# EAGLE design Advertisement Matrix (EAGLE 6.4)
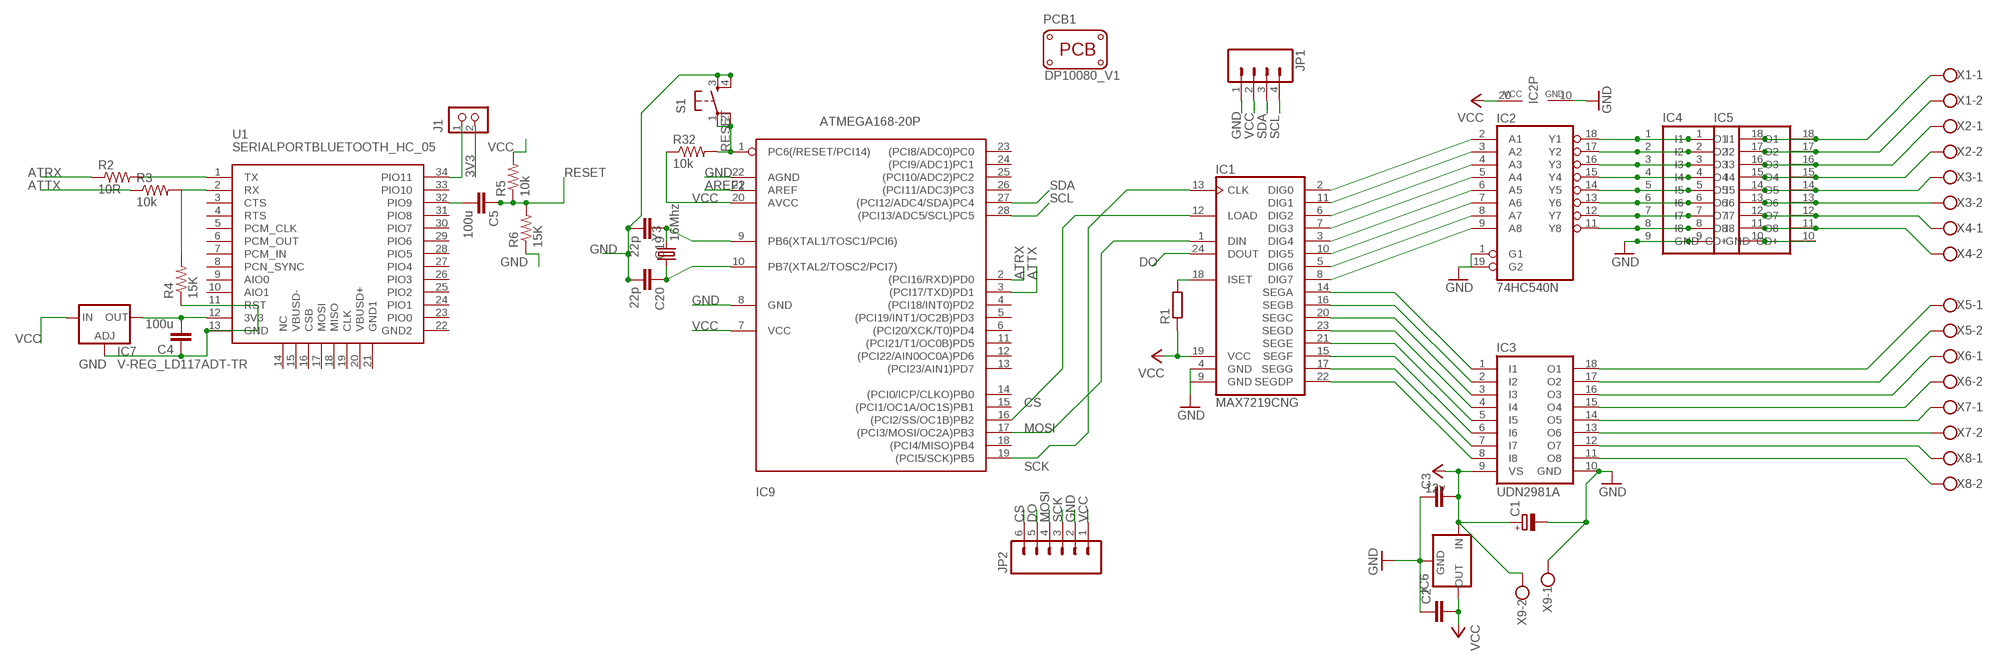
[diagram p0: schematic, sheet 1]

## Parts
C1  CPOL-EUE2.5-7  [E2,5-7]
C2  C-EUC1206K  [C1206K]
C3  C-EUC1206K  [C1206K]
C4  100u  CAP1206  [1206]
C5  100u  CAP1206  [1206]
C19  22p  CAP1206  [1206]
C20  22p  CAP1206  [1206]
IC1  MAX7219CNG  [DIL24-3]
IC2  74HC540N  [DIL20]
IC3  UDN2981A  [DIL18]
IC4  IC_ULN2803AN  [DIL18]
IC5  IC_ULN2803AN  [DIL18]
IC6  78XXL  [78XXL]
IC7  V-REG_LD117ADT-TR  [V-REG_DPACK]
IC9  ATMEGA168-20P  [DIL28-3]
J1  CON_HEADER_1X02-PTH  [M1X2]
JP1  M04POLAR_LOCK  [MOLEX-1X4_LOCK]
JP2  M06POLAR_LOCK  [MOLEX-1X6_LOCK]
PCB1  PCB_DP_RECTANGLE-80X100  [DP10080_V1]
R1  R-EU_0207/7  [0207/7]
R2  10R  R-US_M1206  [M1206]
R3  10k  R-US_M1206  [M1206]
R4  15K  R-US_M1206  [M1206]
R5  10k  R-US_M1206  [M1206]
R6  15K  R-US_M1206  [M1206]
R32  10k  R-US_M1206  [M1206]
S1  TAC_SWITCHPTH  [TACTILE-PTH]
U1  SERIALPORTBLUETOOTH_HC_05  [SERIALPORTBLUETOOTH_BLUETOOTH_SMD]
X1  W237-102  [W237-102]
X2  W237-102  [W237-102]
X3  W237-102  [W237-102]
X4  W237-102  [W237-102]
X5  W237-102  [W237-102]
X6  W237-102  [W237-102]
X7  W237-102  [W237-102]
X8  W237-102  [W237-102]
X9  W237-102  [W237-102]
Y3  16Mhz  CRYSTALSMD  [HC49UP]

## Nets
3V3: C4.2 IC7.4(OUT) J1.2 U1.12(3V3)
12V: C1.+ C3.2 IC3.9(VS) IC6.IN X9.2 ; supply symbol labelled 12v
AREF2: IC9.21(AREF)
ATRX: IC9.2((PCI16/RXD)PD0) R2.1
ATTX: IC9.3((PCI17/TXD)PD1) R3.1
CS: IC1.12(LOAD) IC9.16((PCI2/SS/OC1B)PB2) JP2.6
DO: IC1.24(DOUT) JP2.5
GND: C1.- C2.1 C3.1 C4.1 C19.2 C20.2 IC1.4(GND) IC1.9(GND) IC2.1(G1) IC2.10(GND) IC2.19(G2) IC3.10(GND) IC4.9(GND) IC5.9(GND) IC6.GND IC7.1(ADJ) IC9.8(GND) IC9.22(AGND) JP1.1 JP2.2 R4.1 R6.1 S1.3 S1.4 U1.13(GND) X9.1
MOSI: IC1.1(DIN) IC9.17((PCI3/MOSI/OC2A)PB3) JP2.4
N$1: IC1.2(DIG0) IC2.2(A1)
N$2: IC1.11(DIG1) IC2.3(A2)
N$3: IC1.6(DIG2) IC2.4(A3)
N$4: IC1.7(DIG3) IC2.5(A4)
N$5: IC1.3(DIG4) IC2.6(A5)
N$6: IC1.10(DIG5) IC2.7(A6)
N$7: IC1.5(DIG6) IC2.8(A7)
N$8: IC1.8(DIG7) IC2.9(A8)
N$9: IC1.14(SEGA) IC3.1(I1)
N$10: IC1.16(SEGB) IC3.2(I2)
N$11: IC1.20(SEGC) IC3.3(I3)
N$12: IC1.23(SEGD) IC3.4(I4)
N$13: IC1.21(SEGE) IC3.5(I5)
N$14: IC1.15(SEGF) IC3.6(I6)
N$15: IC1.17(SEGG) IC3.7(I7)
N$16: IC1.22(SEGDP) IC3.8(I8)
N$17: IC2.18(Y1) IC4.1(I1) IC5.1(I1)
N$18: IC2.17(Y2) IC4.2(I2) IC5.2(I2)
N$19: IC2.16(Y3) IC4.3(I3) IC5.3(I3)
N$20: IC2.15(Y4) IC4.4(I4) IC5.4(I4)
N$21: IC2.14(Y5) IC4.5(I5) IC5.5(I5)
N$22: IC2.13(Y6) IC4.6(I6) IC5.6(I6)
N$23: IC2.12(Y7) IC4.7(I7) IC5.7(I7)
N$24: IC2.11(Y8) IC4.8(I8) IC5.8(I8)
N$25: IC3.18(O1) X5.1
N$26: IC3.17(O2) X5.2
N$27: IC3.16(O3) X6.1
N$28: IC3.15(O4) X6.2
N$29: IC3.14(O5) X7.1
N$30: IC3.13(O6) X7.2
N$31: IC3.12(O7) X8.1
N$32: IC3.11(O8) X8.2
N$33: IC4.10(CD+) IC5.10(CD+)
N$34: IC4.11(O8) IC5.11(O8) X4.2
N$35: IC4.12(O7) IC5.12(O7) X4.1
N$36: IC4.13(O6) IC5.13(O6) X3.2
N$37: IC4.14(O5) IC5.14(O5) X3.1
N$38: IC4.15(O4) IC5.15(O4) X2.2
N$39: IC4.16(O3) IC5.16(O3) X2.1
N$40: IC4.17(O2) IC5.17(O2) X1.2
N$41: IC4.18(O1) IC5.18(O1) X1.1
N$42: IC1.18(ISET) R1.2
N$43: R2.2 U1.1(TX)
N$44: R3.2 R4.2 U1.2(RX)
N$45: J1.1 U1.34(PIO11)
N$47: C5.2 U1.32(PIO9)
RESET: C5.1 IC9.1(PC6(/RESET/PCI14)) R5.1 R6.2 R32.2 S1.1 S1.2
SCK: IC1.13(CLK) IC9.19((PCI5/SCK)PB5) JP2.3
SCL: IC9.28((PCI13/ADC5/SCL)PC5) JP1.4
SDA: IC9.27((PCI12/ADC4/SDA)PC4) JP1.3
VCC: C2.2 IC1.19(VCC) IC2.20(VCC) IC6.OUT IC7.3(IN) IC9.7(VCC) IC9.20(AVCC) JP1.2 JP2.1 R1.1 R5.2 R32.1
XTAL5: C20.1 IC9.10(PB7(XTAL2/TOSC2/PCI7)) Y3.1
XTAL6: C19.1 IC9.9(PB6(XTAL1/TOSC1/PCI6)) Y3.2
Unconnected: IC9.4((PCI18/INT0)PD2) IC9.5((PCI19/INT1/OC2B)PD3) IC9.6((PCI20/XCK/T0)PD4) IC9.11((PCI21/T1/OC0B)PD5) IC9.12((PCI22/AIN0OC0A)PD6) IC9.13((PCI23/AIN1)PD7) IC9.14((PCI0/ICP/CLKO)PB0) IC9.15((PCI1/OC1A/OC1S)PB1) IC9.18((PCI4/MISO)PB4) IC9.23((PCI8/ADC0)PC0) IC9.24((PCI9/ADC1)PC1) IC9.25((PCI10/ADC2)PC2) IC9.26((PCI11/ADC3)PC3) U1.3(CTS) U1.4(RTS) U1.5(PCM_CLK) U1.6(PCM_OUT) U1.7(PCM_IN) U1.8(PCN_SYNC) U1.9(AIO0) U1.10(AIO1) U1.11(RST) U1.14(NC) U1.15(VBUSD-) U1.16(CSB) U1.17(MOSI) U1.18(MISO) U1.19(CLK) U1.20(VBUSD+) U1.21(GND1) U1.22(GND2) U1.23(PIO0) U1.24(PIO1) U1.25(PIO2) U1.26(PIO3) U1.27(PIO4) U1.28(PIO5) U1.29(PIO6) U1.30(PIO7) U1.31(PIO8) U1.33(PIO10)

## Library data of the parts
C1 = resistor:CPOL-EU: POLARIZED CAPACITOR, European symbol
C2 C3 = resistor:C-EU: CAPACITOR, European symbol
C4 C5 C19 C20 = SparkFun-Passives:CAP: Capacitor Standard 0603 ceramic capacitor, and 0.1" leaded capacitor.
IC1 = maxim:MAX7219CNG: LED DISPLAY DRIVER; MF: MAXIM; MPN: MAX7219CNG; OC_FARNELL: 1523914; OC_NEWARK: 34C4018
IC2 = 74xx-eu:74*540: Octal BUFFER and LINE DRIVER, 3-state
IC3 = uln-udn:UDN298*: DRIVER ARRAY Source: Allegro Microsystems Inc. / UDN2981-UDN2984.pdf
IC4 IC5 = dp_devices:IC_ULN2803A: DRIVER ARRAY
IC6 = v-reg:78XXL: VOLTAGE REGULATOR
IC7 = untitled:V-REG_LD117A?*: Low drop fixed and adjustable positive voltage regulators 1 A Source: http://www.st.com/stonline/products/literature/ds/7194/ld1117axx.pdf
IC9 = adafruit:ATMEGA168*P: MICROCONTROLLER 16 kBytes FLASH 1 kBytes SRAM 512 Bytes EEPROM USART 8-channel 10 bit ADC
J1 = dp_devices:CON_HEADER_1X02
JP1 = SparkFun-Connectors:M04: Header 4 Standard 4-pin 0.1" header. Use with straight break away headers (SKU : PRT-00116), right angle break away headers (PRT-00553), swiss pins (PRT-00743), machine pins (PRT-00117), and female headers (PRT-00115). Molex polarized connector foot print use with SKU : PRT-08231 with associated crimp pins and housings. 1MM SMD Version SKU: PRT-10208
JP2 = SparkFun-Connectors:M06: Header 6 Standard 6-pin 0.1" header. Use with straight break away headers (SKU : PRT-00116), right angle break away headers (PRT-00553), swiss pins (PRT-00743), machine pins (PRT-00117), and female headers (PRT-00115). Molex polarized connector foot print use with SKU : PRT-08094 with associated crimp pins and housings. NOTES ON THE VARIANTS LOCK and LOCK_LONGPADS... This footprint was designed to help hold the alignment of a through-hole component (i.e. 6-pin header) while soldering it into place. You may notice that each hole has been shifted either up or down by 0.005 of an inch from it's more standard position (which is a perfectly straight line). This slight alteration caused the pins (the squares in the middle) to touch the edges of the holes. Because they are alternating, it causes a "brace" to hold the component in place. 0.005 has proven to be the perfect amount of "off-center" position when using our standard breakaway headers. Although looks a little odd when you look at the bare footprint, once you have a header in there, the alteration is very hard to notice. Also,if you push a header all the way into place, it is covered up entirely on the bottom side. This idea of altering the position of holes to aid alignment will be further integrated into the Sparkfun Library for other footprints. It can help hold any component with 3 or more connection pins.
PCB1 = dp_devices:PCB_DP_RECTANGLE: Dangerous Prototypes Standard Rectangular PCB sizes; PCB_SIZE: DP10080_V1
R1 = rcl:R-EU_: RESISTOR, European symbol
R2-R6 R32 = resistor:R-US_: RESISTOR, American symbol
S1 = SparkFun-Electromechanical:TAC_SWITCH: Momentary Switch Button commonly used for reset or general input. Spark Fun Electronics SKU : COM-00097 SMT- SWCH-08247
U1 = untitled:SERIALPORTBLUETOOTH_HC_05
X1-X9 = con-wago-500:W237-102: WAGO SCREW CLAMP; MPN: 237-102; OC_FARNELL: unknown; OC_NEWARK: 70K9898
Y3 = SparkFun-FreqCtrl:CRYSTAL: Various standard crystals. Proven footprints. Spark Fun Electronics SKU : COM-00534

## Board
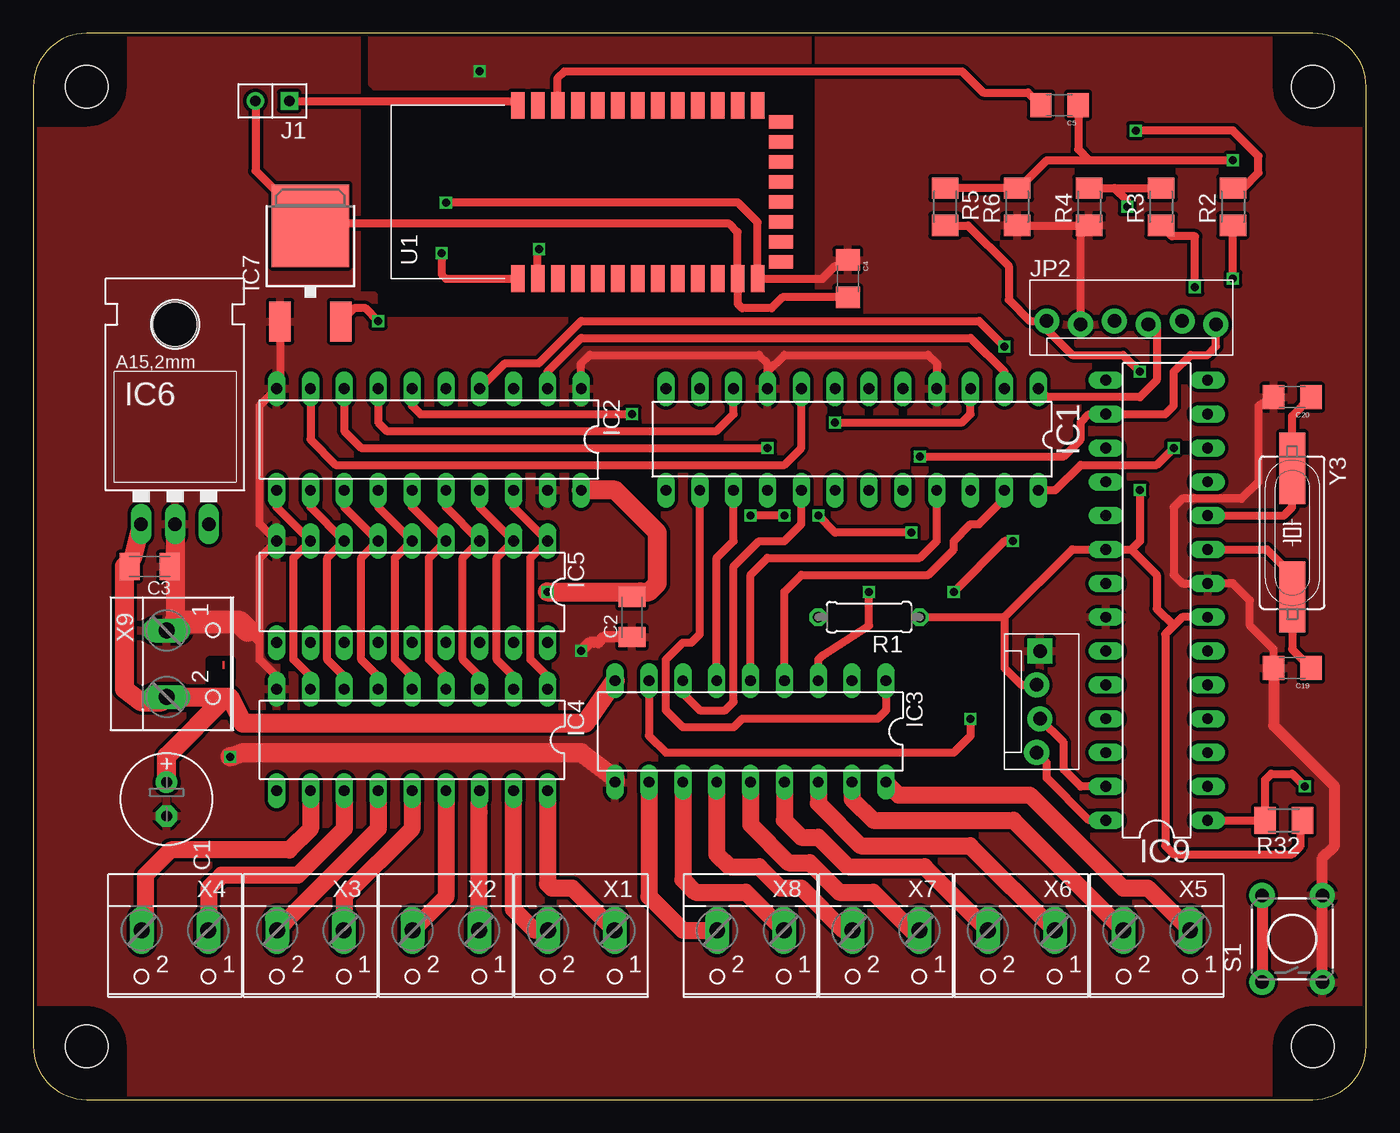
[diagram p1: board, top side]
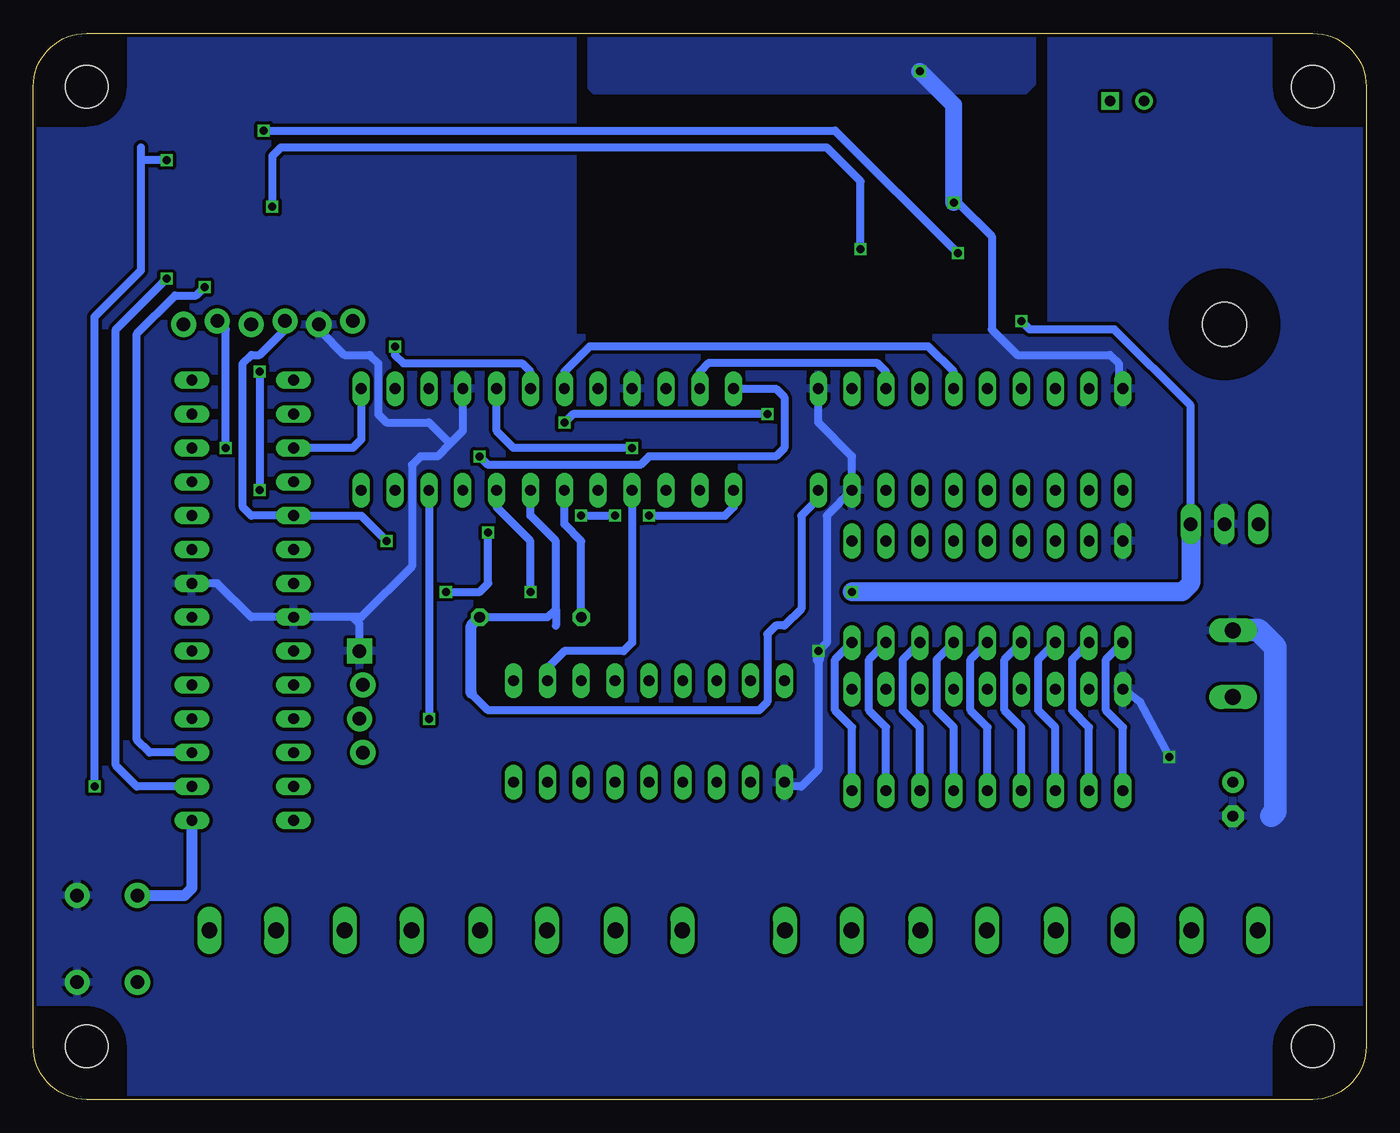
[diagram p2: board, bottom side, seen from below]

Size 100 x 80 mm. Coordinates in mm from the lower left corner, seen from the top.
Copper layers (1*16): Top 0.035mm / dielectric 1.5mm / Bottom 0.035mm
Design rules "dirt_cheap_dirty_boards.v1 *": minimum track width 5mil, minimum drill 12mil, track to track 10mil, track to pad 10mil, pad to pad 10mil, via to via 10mil, smd to smd 0mil, copper to edge 10mil, drill to drill 10mil, minimum pad ring 10mil, minimum via ring 6mil, stop-mask expansion 2mil, vias tented up to drill 25mil, thermal gap 10mil

### Footprints (pad centres in the part's own frame; a part is rotated, then mirrored left to right if it is on the bottom)
E2,5-7 = drill 0.813 pad 1.6: + -1.27,0 | drill 0.813 pad 1.6 octagon: - 1.27,0
C1206K = smd 1.5 x 2: 1 -1.5,0; 2 1.5,0
1206 = smd 1.6 x 1.8: 1 -1.4,0; 2 1.4,0
DIL24-3 = drill 0.813 long: 1 -13.97,-3.81; 2 -11.43,-3.81; 3 -8.89,-3.81; 4 -6.35,-3.81; 5 -3.81,-3.81; 6 -1.27,-3.81; 7 1.27,-3.81; 8 3.81,-3.81; 9 6.35,-3.81; 10 8.89,-3.81; 11 11.43,-3.81; 12 13.97,-3.81; 13 13.97,3.81; 14 11.43,3.81; 15 8.89,3.81; 16 6.35,3.81; 17 3.81,3.81; 18 1.27,3.81; 19 -1.27,3.81; 20 -3.81,3.81; 21 -6.35,3.81; 22 -8.89,3.81; 23 -11.43,3.81; 24 -13.97,3.81
DIL20 = drill 0.813 long: 1 -11.43,-3.81; 2 -8.89,-3.81; 3 -6.35,-3.81; 4 -3.81,-3.81; 5 -1.27,-3.81; 6 1.27,-3.81; 7 3.81,-3.81; 8 6.35,-3.81; 9 8.89,-3.81; 10 11.43,-3.81; 11 11.43,3.81; 12 8.89,3.81; 13 6.35,3.81; 14 3.81,3.81; 15 1.27,3.81; 16 -1.27,3.81; 17 -3.81,3.81; 18 -6.35,3.81; 19 -8.89,3.81; 20 -11.43,3.81
DIL18 = drill 0.813 long: 1 -10.16,-3.81; 2 -7.62,-3.81; 3 -5.08,-3.81; 4 -2.54,-3.81; 5 0,-3.81; 6 2.54,-3.81; 7 5.08,-3.81; 8 7.62,-3.81; 9 10.16,-3.81; 10 10.16,3.81; 11 7.62,3.81; 12 5.08,3.81; 13 2.54,3.81; 14 0,3.81; 15 -2.54,3.81; 16 -5.08,3.81; 17 -7.62,3.81; 18 -10.16,3.81
78XXL = drill 1.016 long: GND 0,-3.81; IN -2.54,-3.81; OUT 2.54,-3.81 | hole 3.302: 0,11.176
V-REG_DPACK = smd 1.6 x 3: 1 -2.28,-4.8; 3 2.28,-4.8 | smd 5.8 x 6.2: 4 0,2.38
DIL28-3 = drill 0.813 long: 1 -16.51,-3.81; 2 -13.97,-3.81; 3 -11.43,-3.81; 4 -8.89,-3.81; 5 -6.35,-3.81; 6 -3.81,-3.81; 7 -1.27,-3.81; 8 1.27,-3.81; 9 3.81,-3.81; 10 6.35,-3.81; 11 8.89,-3.81; 12 11.43,-3.81; 13 13.97,-3.81; 14 16.51,-3.81; 15 16.51,3.81; 16 13.97,3.81; 17 11.43,3.81; 18 8.89,3.81; 19 6.35,3.81; 20 3.81,3.81; 21 1.27,3.81; 22 -1.27,3.81; 23 -3.81,3.81; 24 -6.35,3.81; 25 -8.89,3.81; 26 -11.43,3.81; 27 -13.97,3.81; 28 -16.51,3.81
M1X2 = drill 0.8 square: 1 -1.27,0 | drill 0.8: 2 1.27,0
MOLEX-1X4_LOCK = drill 1.016 pad 1.88 square: 1 0,0.127 | drill 1.016 pad 1.88: 2 2.54,-0.127; 3 5.08,0.127; 4 7.62,-0.127
MOLEX-1X6_LOCK = drill 1.016 pad 1.88: 1 0,0; 2 2.54,-0.254; 3 5.08,0; 4 7.62,-0.254; 5 10.16,0; 6 12.7,-0.254
DP10080_V1 = hole 3.2: -46,-36; 46,-36; 46,36; -46,36
0207/7 = drill 0.813 octagon: 1 -3.81,0; 2 3.81,0
M1206 = smd 1.6 x 2: 1 -1.4,0; 2 1.4,0
TACTILE-PTH = drill 1.016 pad 1.88: 1 -3.251,2.261; 2 3.251,2.261; 3 -3.251,-2.261; 4 3.251,-2.261
SERIALPORTBLUETOOTH_BLUETOOTH_SMD = smd 2 x 1: 1 0,0; 2 0,-1.5; 3 0,-3; 4 0,-4.5; 5 0,-6; 6 0,-7.5; 7 0,-9; 8 0,-10.5; 9 0,-12; 10 0,-13.5; 11 0,-15; 12 0,-16.5; 13 0,-18; 22 13,-18; 23 13,-16.5; 24 13,-15; 25 13,-13.5; 26 13,-12; 27 13,-10.5; 28 13,-9; 29 13,-7.5; 30 13,-6; 31 13,-4.5; 32 13,-3; 33 13,-1.5; 34 13,0 | smd 1 x 1.8: 14 1.25,-19.75; 15 2.75,-19.75; 16 4.25,-19.75; 17 5.75,-19.75; 18 7.25,-19.75; 19 8.75,-19.75; 20 10.25,-19.75; 21 11.75,-19.75
W237-102 = drill 1.194 long: 1 -2.5,-1.27; 2 2.5,-1.27
HC49UP = smd 5.334 x 1.93: 1 -4.826,0; 2 4.826,0

### Placement (x,y rotation side)
C1  10,22.54 270 top
C2  44.92,36.19 90 top
C3  8.73,40 180 top
C4  61.11,61.59 270 top
C5  76.99,74.61 180 top
C19  94.45,32.38 180 top
C20  94.45,52.7 180 top
IC1  61.43,49.52 180 top
IC2  29.68,49.52 180 top
IC3  53.81,27.62 180 top
IC4  28.41,26.98 180 top
IC5  28.41,38.09 180 top
IC6  10.63,46.98 0 top
IC7  20.79,63.18 0 top
IC9  84.29,37.46 90 top
J1  17.93,74.93 180 top
JP1  75.4,33.65 270 top
JP2  76.03,58.41 0 top
PCB1  50,40 0 top
R1  62.7,36.19 180 top
R2  90,66.99 90 top
R3  84.61,66.99 90 top
R4  79.21,66.99 90 top
R5  68.42,66.99 270 top
R6  73.81,66.99 90 top
R32  93.81,20.95 180 top
S1  94.45,12.06 90 top
U1  36.35,61.59 90 top
X1  41.11,11.43 180 top
X2  30.95,11.43 180 top
X3  20.79,11.43 180 top
X4  10.63,11.43 180 top
X5  84.29,11.43 180 top
X6  74.13,11.43 180 top
X7  63.97,11.43 180 top
X8  53.81,11.43 180 top
X9  11.27,32.7 270 top
Y3  94.45,42.54 270 top

### Tracks (layer width: path | path; a pad name or v marks a point on that pad's centre or on a via)
3V3
  Top 0.61: C4.2 56.22,60.19 55.4,59.37 53.18,59.37 52.86,59.69 52.86,61.58 U1.12 52.85,65.09 52.22,65.72 20.95,65.72 IC7.4 16.66,69.69 J1.2
12V
  Top 0.813: C3.2 6.82,40
  Top 1.422: 14.44,30.2 X9.2 9.64,29.84 8.09,29.84 6.82,30.79 6.82,40 7.46,40.63 IC6.IN | 14.44,30.2 14.72,30.2 15.71,28.25 41.43,28.25 IC3.9 | C1.+ 10,25.75 14.44,30.2
ATRX  (via drill 0.6)
  Top 0.61: v90,61.59 R2.1
  Bottom 0.61: IC9.2 92.23,23.49 93.81,25.08 93.81,57.78 v90,61.59
ATTX  (via drill 0.6)
  Top 0.61: v87.15,60.95 87.15,64.77 85.43,64.77 R3.1
  Bottom 0.61: IC9.3 91.28,26.03 92.23,26.98 92.23,57.46 89.37,60.32 87.78,60.32 v87.15,60.95
CS  (via drill 0.6)
  Top 0.61: v66.51,48.26 77.31,48.26 78.58,49.52 78.58,50.8 79.21,51.43 IC9.16 84.92,51.43 85.56,52.07 85.56,54.61 86.83,55.88 88.1,55.88 88.73,56.51 JP2.6
  Bottom 0.61: IC1.12 44.29,53.34 43.65,52.7 43.65,48.89 44.29,48.26 53.81,48.26 54.45,47.62 65.88,47.62 v66.51,48.26
DO  (via drill 0.6)
  Top 0.61: IC1.24 76.67,45.72 78.58,47.62 84.29,47.62 v85.56,48.89
  Bottom 0.61: v85.56,48.89 85.56,57.78 JP2.5
GND  (via drill 0.6)
  Top 0.61: IC4.9 18.25,31.75 16.98,33.02 16.98,34.29 | 16.98,34.29 16.98,40.63 IC5.9 16.98,43.18 16.98,52.07 IC2.10 18.51,53.59 IC7.1 | 16.07,35.2 16.98,34.29 | IC2.1 41.11,55.24 41.75,55.88 54.45,55.88 55.08,55.24 IC1.9 55.08,54.61 56.35,55.88 67.15,55.88 67.78,55.24 IC1.4 | C19.2 93.05,33.78 91.28,35.55 91.28,37.46 90,38.73 IC9.8 86.2,38.73 85.56,39.37 85.56,44.45 86.2,45.08 90.64,45.08 91.91,46.35 91.91,52.07 C20.2 | R6.1 R4.1 78.58,64.95 JP2.2 | C4.1 60.16,62.54 59.21,61.59 U1.13 54.35,65.81 52.86,67.31 v30.95,67.31
  Top 0.813: C2.1 42.79,34.69 42.38,34.29 41.75,34.29 v41.11,33.65 | C3.1 10.63,40 | S1.3 S1.4 96.71,18.13 97.62,19.05 97.62,23.49 93.05,28.07 C19.2
  Top 1.422: v14.76,25.71 15.71,26.03 41.11,26.03 43.65,24.12 IC3.10 | IC6.GND 10.63,40 10.63,35.83 X9.1
  Top 1.676: 10.63,35.83 15.43,35.83 16.07,35.2
  Bottom 0.61: IC2.1 41.11,50.8 38.57,48.26 IC2.19 40.48,43.81 40.48,34.29 v41.11,33.65 | 41.11,33.02 41.11,24.76 42.38,23.49 43.33,23.49 IC3.10 | IC4.9 16.98,29.84 v14.76,25.71 | IC1.4 67.78,50.16 68.73,49.21 | 68.73,49.21 69.69,48.26 70.95,48.26 71.59,47.62 71.59,40 75.4,36.19 76.03,36.19 | 76.03,36.19 IC9.22 83.66,36.19 86.2,38.73 IC9.8 | JP1.1 75.53,35.68 76.03,36.19 | JP2.2 78.58,57.78 76.67,55.88 74.77,55.88 74.13,55.24 74.13,51.43 73.5,50.8 70.32,50.8 68.73,49.21 | v30.95,67.31 30.63,67.31 28.09,64.77 28.09,57.78 26.19,55.88 19.2,55.88 18.57,55.24 18.57,53.65 IC2.10
  Bottom 0.813: v41.11,33.65 41.11,33.02
  Bottom 1.27: v30.95,67.31 30.95,74.61 v33.49,77.15
  Bottom 1.676: 7.14,21.27 6.82,21.59 6.82,33.97 8.09,35.24 9.96,35.24 X9.1
  pour Top: 25.55,60.32 24.28,60.32 24.28,80 -2.39,80 -2.39,-2.54 102.7,-2.54 102.7,83.81 58.89,83.81 58.89,58.41 25.55,58.41
  pour Bottom: 23.65,81.59 23.65,57.15 59.52,57.15 59.52,80.64 101.12,80.64 101.12,-2.23 -1.12,-2.23 -1.12,80.96 22.7,80.96 22.7,81.59
  pour Top: 25.23,80.64 25.23,76.19 25.55,75.88 57.62,75.88 58.26,76.51 58.26,80.32 57.94,80.64
  pour Bottom: 24.92,80.32 24.92,76.19 25.55,75.56 57.94,75.56 58.26,75.88 58.26,80 57.94,80.32
MOSI
  Top 0.61: JP2.4 84.29,58.16 84.29,53.97 83.02,52.7 76.03,52.7 IC1.1
  Bottom 0.61: IC1.1 75.4,49.52 76.03,48.89 IC9.17
N$1
  Top 0.61: IC2.2 38.57,54.61 41.11,57.15 70.32,57.15 72.86,54.61 IC1.2
N$2
  Bottom 0.61: IC2.3 36.03,54.61 36.66,55.24 49.37,55.24 50,54.61 IC1.11
N$3  (via drill 0.6)
  Top 0.61: IC2.4 35.39,55.24 37.94,55.24 41.11,58.41 70.95,58.41 v72.86,56.51
  Bottom 0.61: v72.86,56.51 72.86,55.88 72.22,55.24 63.34,55.24 62.7,54.61 IC1.6
N$4
  Bottom 0.61: IC2.5 30.95,54.61 32.86,56.51 58.26,56.51 60.16,54.61 IC1.7
N$5  (via drill 0.6)
  Top 0.61: IC2.6 28.41,52.07 29.05,51.43 v44.92,51.43 | v60.16,50.8 69.69,50.8 70.32,51.43 IC1.3
  Bottom 0.61: v44.92,51.43 59.52,51.43 v60.16,50.8
N$6
  Top 0.61: IC2.7 25.87,50.8 26.51,50.16 51.27,50.16 52.54,51.43 IC1.10
N$7  (via drill 0.6)
  Top 0.61: IC2.8 23.33,50.16 24.6,48.89 v55.08,48.89
  Bottom 0.61: v55.08,48.89 63.97,48.89 65.24,50.16 IC1.5
N$8
  Top 0.61: IC2.9 20.79,49.52 22.7,47.62 56.35,47.62 57.62,48.89 IC1.8
N$9
  Top 0.61: IC3.1 63.97,29.21 63.34,28.57 53.18,28.57 52.54,27.94 48.73,27.94 47.46,29.21 47.46,33.02 48.73,34.29 49.37,34.29 50,34.92 IC1.14
N$10
  Bottom 0.61: IC1.16 55.08,34.29 55.72,33.65 60.16,33.65 61.43,32.38 IC3.2
N$11  (via drill 0.6)
  Top 0.61: IC3.3 58.89,33.02 59.21,33.33 62.7,35.55 v62.7,38.09
  Bottom 0.61: v62.7,38.09 62.7,41.91 65.24,44.45 IC1.20
N$12
  Top 0.61: IC3.4 56.35,38.09 57.62,39.37 67.15,39.37 69.05,41.27 69.05,41.91 70.32,43.18 70.95,43.18 72.86,45.08 IC1.23
N$13
  Top 0.61: IC3.5 53.81,39.37 55.08,40.63 66.51,40.63 67.78,41.91 IC1.21
N$14
  Top 0.61: IC3.6 51.27,40.63 52.54,41.91 IC1.15
N$15
  Top 0.61: IC3.7 48.73,30.48 50,29.21 51.91,29.21 52.54,29.84 52.54,40 54.45,41.91 56.35,41.91 57.62,43.18 IC1.17
N$16  (via drill 0.6)
  Top 0.61: IC3.8 46.19,27.3 47.46,26.03 69.05,26.03 70.32,27.3 v70.32,28.57
  Bottom 0.61: IC1.22 v70.32,28.57
N$17
  Top 0.61: IC4.1 38.57,31.75 37.3,33.02 37.3,40.63 IC5.1 36.03,44.45 IC2.18
N$18
  Top 0.61: IC4.2 36.03,31.75 34.76,33.02 34.76,40.63 IC5.2 33.49,44.45 IC2.17
N$19
  Top 0.61: IC4.3 33.49,31.75 32.22,33.02 32.22,40.63 IC5.3 30.95,44.45 IC2.16
N$20
  Top 0.61: IC4.4 30.95,31.75 29.68,33.02 29.68,40.63 IC5.4 28.41,44.45 IC2.15
N$21
  Top 0.61: IC4.5 28.41,31.75 27.14,33.02 27.14,40.63 IC5.5 25.87,44.45 IC2.14
N$22
  Top 0.61: IC4.6 25.87,31.75 24.6,33.02 24.6,40.63 IC5.6 23.33,44.45 IC2.13
N$23
  Top 0.61: IC4.7 23.33,31.75 22.06,33.02 22.06,40.63 IC5.7 20.79,44.45 IC2.12
N$24
  Top 0.61: IC4.8 20.79,31.75 19.52,33.02 19.52,40.63 IC5.8 18.25,44.45 IC2.11
N$25
  Top 1.27: IC3.18 64.92,22.86 74.77,22.86 81.75,15.87 83.61,15.87 X5.1
N$26
  Top 1.27: IC3.17 61.43,22.54 63.02,20.95 73.53,20.95 X5.2
N$27
  Top 1.27: IC3.16 58.89,22.22 62.06,19.05 70.28,19.05 X6.1
N$28
  Top 1.27: IC3.15 56.35,20.95 57.62,19.68 58.89,19.68 61.11,17.46 66.87,17.46 X6.2
N$29
  Top 1.27: IC3.14 53.81,20.63 56.67,17.78 58.26,17.78 60.48,15.55 63.02,15.55 65.88,12.7 X7.1
N$30
  Top 1.27: IC3.13 51.27,18.41 52.22,17.46 54.45,17.46 56.03,15.87 57.62,15.87 60.8,12.7 X7.2
N$31
  Top 1.27: IC3.12 48.73,16.51 49.68,15.55 53.45,15.55 X8.1
N$32
  Top 1.27: IC3.11 46.19,15.24 48.73,12.7 X8.2
N$33
  Bottom 0.61: IC4.10 18.25,27.94 19.52,29.21 19.52,33.02 IC5.10
N$34
  Top 1.27: IC4.11 20.79,20.32 19.2,18.73 10.31,18.73 8.41,16.82 8.41,12.97 X4.2
  Bottom 0.61: IC4.11 20.79,27.94 22.06,29.21 22.06,33.02 IC5.11
N$35
  Top 1.27: IC4.12 23.33,20.32 19.84,16.82 14.12,16.82 13.17,15.87 13.17,12.74 X4.1
  Bottom 0.61: IC4.12 23.33,27.94 24.6,29.21 24.6,33.02 IC5.12
N$36
  Top 1.27: IC4.13 25.87,20.32 18.89,13.33 18.89,13.29 X3.2
  Bottom 0.61: IC4.13 25.87,27.94 27.14,29.21 27.14,33.02 IC5.13
N$37
  Top 1.27: IC4.14 28.41,20.32 23.33,15.24 23.33,12.74 X3.1
  Bottom 0.61: IC4.14 28.41,27.94 29.68,29.21 29.68,33.02 IC5.14
N$38
  Top 1.27: IC4.15 30.95,15.2 X2.2
  Bottom 0.61: IC4.15 30.95,27.94 32.22,29.21 32.22,33.02 IC5.15
N$39
  Top 1.27: X2.1 33.45,21.55 IC4.16
  Bottom 0.61: IC4.16 33.49,27.94 34.76,29.21 34.76,33.02 IC5.16
N$40
  Top 1.27: X1.2 37.62,12.7 36.03,14.28 IC4.17
  Bottom 0.61: IC4.17 36.03,27.94 37.3,29.21 37.3,33.02 IC5.17
N$41
  Top 1.27: IC4.18 38.57,16.19 38.89,15.87 40.44,15.87 X1.1
  Bottom 0.61: IC4.18 38.57,27.94 39.84,29.21 39.84,33.02 IC5.18
N$42
  Bottom 0.61: R1.2 58.89,41.91 60.16,43.18 IC1.18
N$43  (via drill 0.6)
  Top 0.61: R2.2 90.77,68.39 91.91,69.53 91.91,70.8 90,72.7 v82.7,72.7 | v30.63,63.49 30.63,61.91 30.95,61.59 U1.1
  Bottom 0.61: v82.7,72.7 39.84,72.7 v30.63,63.49
N$44  (via drill 0.6)
  Top 0.61: R4.2 81.11,68.39 | 81.11,68.39 R3.2 | U1.2 37.85,63.73 v37.94,63.81 | v82.07,66.99 82.07,67.44 81.11,68.39
  Bottom 0.61: v37.94,63.81 37.94,68.89 40.48,71.43 81.43,71.43 82.07,70.8 v82.07,66.99
N$45
  Top 0.61: J1.1 36.01,74.93 U1.34
N$47
  Top 0.61: U1.32 39.35,76.66 39.84,77.15 69.69,77.15 71.27,75.56 74.64,75.56 C5.2
RESET  (via drill 0.6)
  Top 0.61: IC9.1 R32.2 92.42,24 92.86,24.44 94.45,24.44 v95.4,23.49 | R5.1 R6.2 73.94,68.39 76.03,70.48 79.21,70.48 | 79.21,70.48 v90,70.48 | C5.1 78.39,71.3 79.21,70.48
  Top 0.813: S1.2 S1.1
  Bottom 0.61: v95.4,23.49 95.4,58.73 91.91,62.23 91.91,70.48 | 91.91,70.48 91.91,71.43 | v90,70.48 91.91,70.48
  Bottom 0.813: S1.2 88.66,15.31 88.1,15.87 IC9.1
SCK  (via drill 0.6)
  Top 0.61: v73.5,41.91 72.86,41.91 v69.05,38.09 | v65.88,42.54 60.16,42.54 v58.89,43.81 | v56.35,43.81 v53.81,43.81
  Bottom 0.61: v73.5,41.91 75.4,43.81 IC9.19 83.66,43.81 84.29,44.45 84.29,55.24 83.66,55.88 83.02,55.88 81.11,57.78 JP2.3 | v69.05,38.09 66.51,38.09 65.88,38.73 v65.88,42.54 | v58.89,43.81 v56.35,43.81 | v53.81,43.81 48.09,43.81 47.46,44.45 IC1.13
SCL
  Top 0.61: IC9.28 79.21,20.95 76.03,24.12 76.03,25.27 JP1.4
SDA
  Top 0.61: IC9.27 78.58,23.49 77.31,24.76 77.31,26.79 JP1.3
VCC  (via drill 0.6)
  Top 0.61: IC9.7 86.2,36.19 85.56,35.55 | 85.56,35.55 84.92,34.92 84.92,19.05 85.56,18.41 94.45,18.41 95.09,19.05 95.09,20.82 R32.1 | R1.1 72.86,36.19 | 72.86,36.19 77.94,41.27 IC9.20 82.39,41.27 | 82.39,41.27 84.29,39.37 84.29,36.83 85.56,35.55 | 72.86,36.19 72.86,32.38 74.13,31.11 JP1.2 | v83.02,54.61 81.75,55.88 77.94,55.88 76.03,57.78 JP2.1 74.77,58.41 73.18,60 73.18,62.54 70.13,65.59 R5.2 | v83.02,45.72 83.02,41.91 82.39,41.27 | v25.87,58.41 24.92,59.37 24.06,59.37 IC7.3
  Top 0.813: C2.2 45.15,37.69 45.55,38.09
  Top 1.422: v38.57,38.09 45.55,38.09 46.19,38.09 46.83,38.73 46.83,42.54 43.65,45.72 IC2.20
  Bottom 0.61: R1.1 61.43,36.19 60.8,36.83 | 60.8,36.83 60.8,41.91 62.7,43.81 IC1.19 | IC2.20 41.11,45.08 42.38,43.81 42.38,36.83 43.65,35.55 44.29,35.55 44.92,34.92 44.92,29.84 45.55,29.21 65.88,29.21 67.15,30.48 | 60.8,36.83 60.8,35.55 | v83.02,54.61 v83.02,45.72 | IC6.OUT 13.17,52.07 18.89,57.78 25.23,57.78 v25.87,58.41
  Bottom 0.813: 67.15,30.48 67.15,35.55 R1.1
  Bottom 1.422: IC6.OUT 13.17,38.73 13.81,38.09 v38.57,38.09
XTAL5
  Top 0.61: IC9.10 93.81,43.81 94.45,44.45 Y3.1 94.45,51.3 C20.1
XTAL6
  Top 0.61: IC9.9 92.55,41.27 94.45,39.37 Y3.2 94.45,33.78 C19.1

### Text on the board
Top: -
tCream: CC-BY-SA
bCream: Design by: | Thanks Mark! | Peter vd Walt | Sponsored by: www.OpenBuilds.com FairShare Program
OPENHWSILK: BT-KEY-3.3 | 104\ | 10K | BLUETOOTH | 15K | 15K | 10K | 10-R | 1117-3.3 | VCC | GND | SCK | DI | DO | CS | 7805 | 22P | 74HC540 | MAX7219 | OPENHARDWARE.CO.ZA | 16MHZ | 104 | 104 | ULN2803 | ISET | - | GND | VCC | 22P | 12V-IN | + | SDA | UDN2981 | + | ULN2803 | SCL | + | ATMEGA328P | 10K | 12V LED Matrix Driver | 100u | with Bluetooth | RESET | 8 | 7 | 6 | 5 | 4 | 3 | 2 | 1 | 8 | 7 | 6 | 5 | 4 | 3 | 2 | 1 | COLUMNS | = GND | ROWS | = 12V